# Altium schematic sheet fhd-gs.SchDoc: fhd-gs
size 453 x 317 mm; Origin: Eagle; Date: 4/28/2023 9:43:15 AM; SheetNumber: 1; GateName_1: G$1; SymbolName_1: FRAME_B_L; LibraryName: frames; DeviceSetName: FRAME_B_L; GateName_2: G$2; SymbolName_2: DOCFIELD; Sheet: Sheet:; REV: REV:
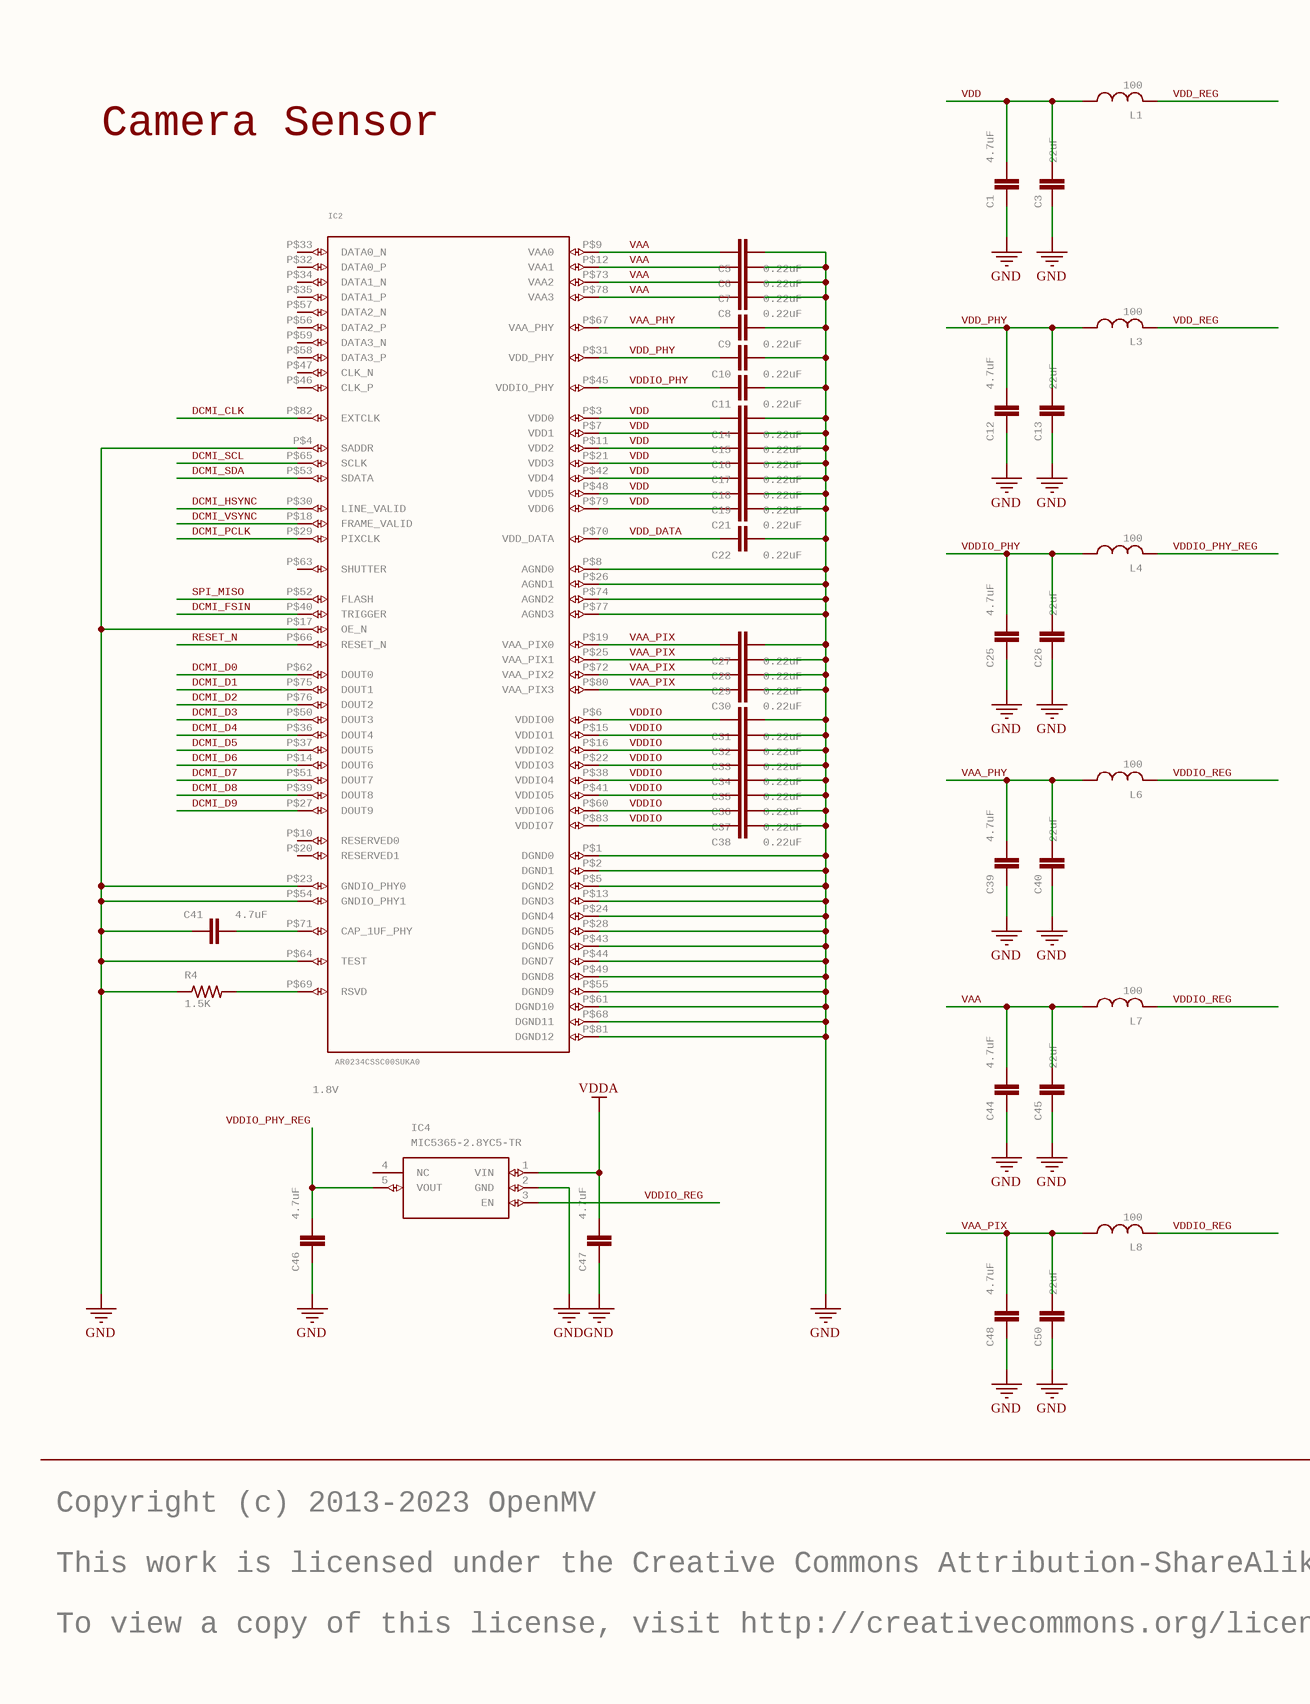
[diagram p0: fhd-gs.SchDoc, left]
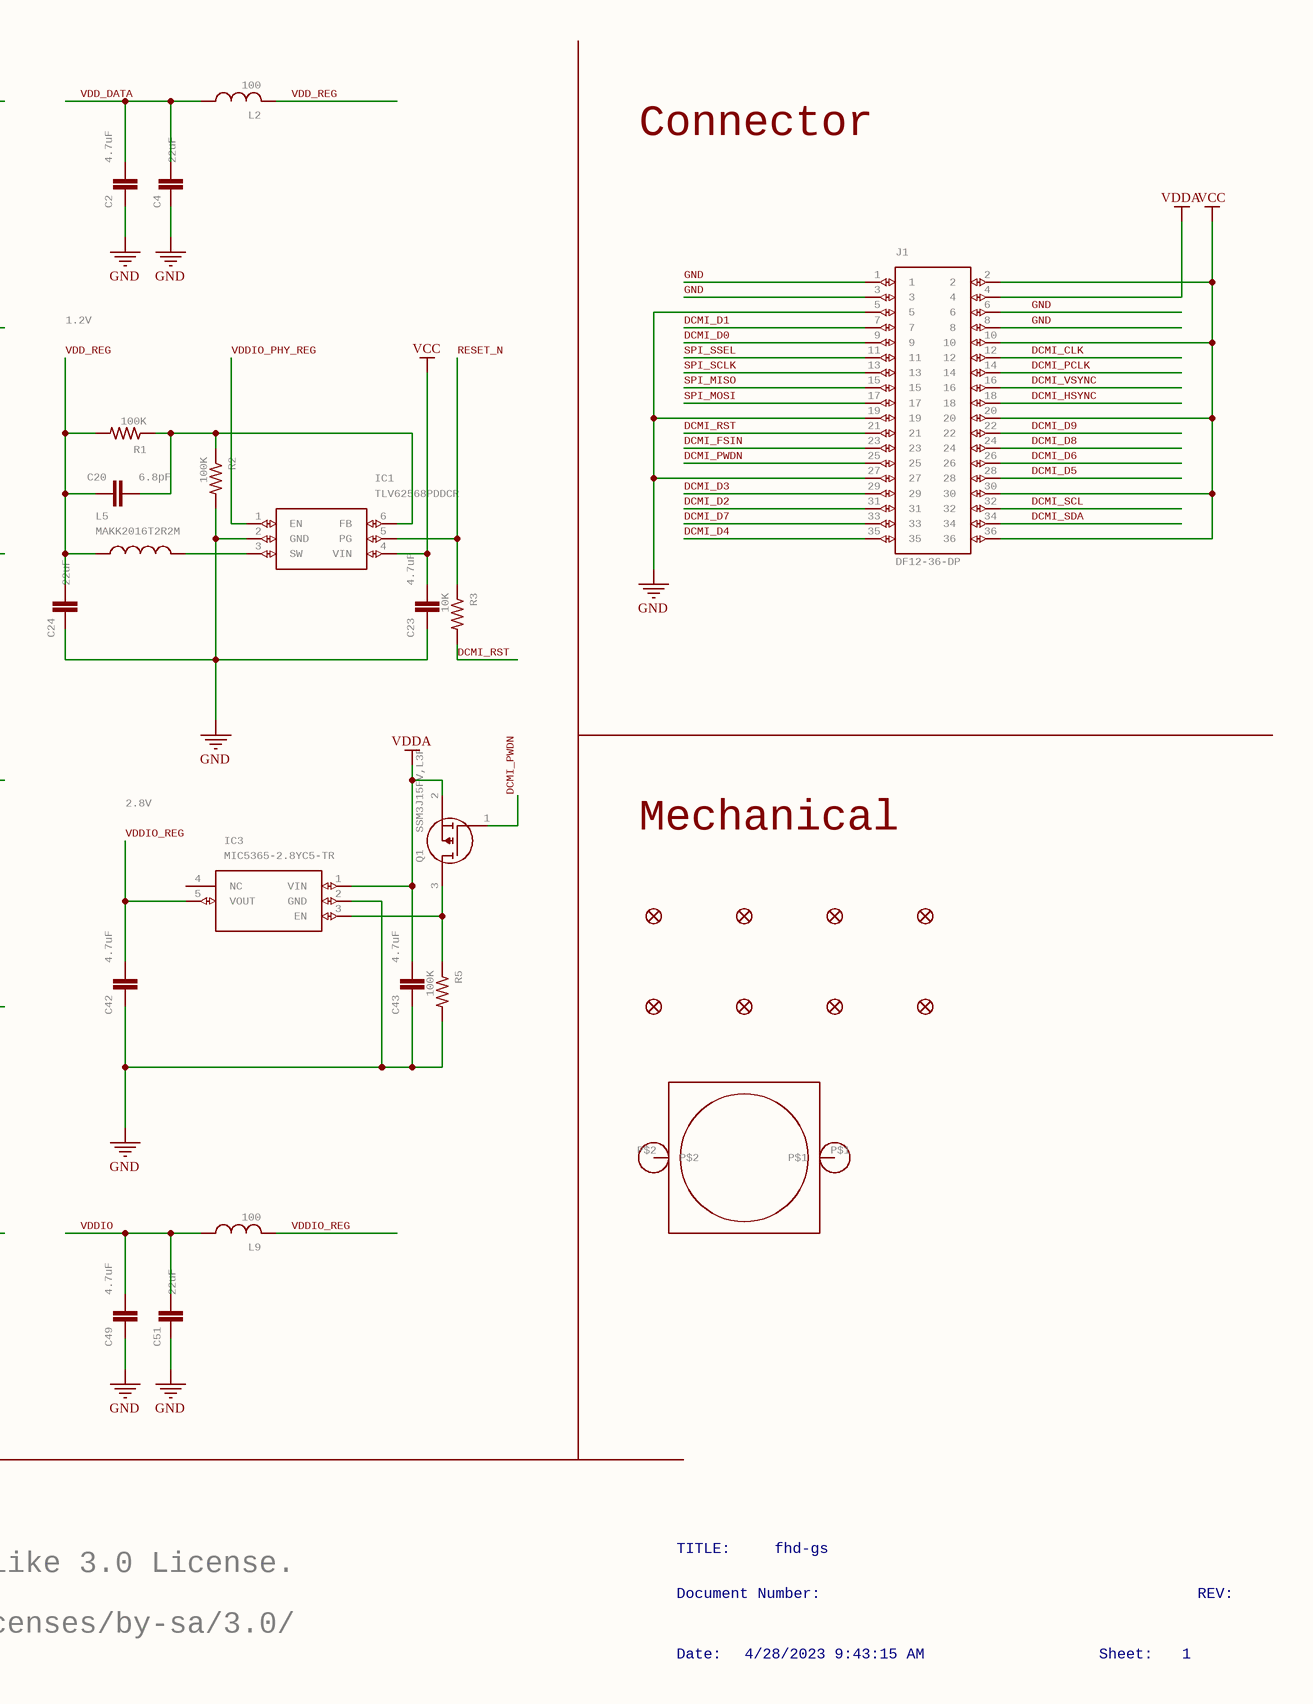
[diagram p1: fhd-gs.SchDoc, right]

## Parts
C1  4.7uF  [0402]
C2  4.7uF  [0402]
C3  22uF  [0805]
C4  22uF  [0805]
C5  0.22uF  [C0201]
C6  0.22uF  [C0201]
C7  0.22uF  [C0201]
C8  0.22uF  [C0201]
C9  0.22uF  [C0201]
C10  0.22uF  [C0201]
C11  0.22uF  [C0201]
C12  4.7uF  [0402]
C13  22uF  [0805]
C14  0.22uF  [C0201]
C15  0.22uF  [C0201]
C16  0.22uF  [C0201]
C17  0.22uF  [C0201]
C18  0.22uF  [C0201]
C19  0.22uF  [C0201]
C20  6.8pF  [0402]
C21  0.22uF  [C0201]
C22  0.22uF  [C0201]
C23  4.7uF  [0402]
C24  22uF  [0805]
C25  4.7uF  [0402]
C26  22uF  [0805]
C27  0.22uF  [C0201]
C28  0.22uF  [C0201]
C29  0.22uF  [C0201]
C30  0.22uF  [C0201]
C31  0.22uF  [C0201]
C32  0.22uF  [C0201]
C33  0.22uF  [C0201]
C34  0.22uF  [C0201]
C35  0.22uF  [C0201]
C36  0.22uF  [C0201]
C37  0.22uF  [C0201]
C38  0.22uF  [C0201]
C39  4.7uF  [0402]
C40  22uF  [0805]
C41  4.7uF  [0402]
C42  4.7uF  [0402]
C43  4.7uF  [0402]
C44  4.7uF  [0402]
C45  22uF  [0805]
C46  4.7uF  [0402]
C47  4.7uF  [0402]
C48  4.7uF  [0402]
C49  4.7uF  [0402]
C50  22uF  [0805]
C51  22uF  [0805]
FD1  FIDUCIAL1X2  [FIDUCIAL-1X2]  (value not drawn)
FD2  FIDUCIAL1X2  [FIDUCIAL-1X2]  (value not drawn)
FD3  FIDUCIAL1X2  [FIDUCIAL-1X2]  (value not drawn)
FD4  FIDUCIAL1X2  [FIDUCIAL-1X2]  (value not drawn)
FD5  FIDUCIAL1X2  [FIDUCIAL-1X2]  (value not drawn)
FD6  FIDUCIAL1X2  [FIDUCIAL-1X2]  (value not drawn)
FD7  FIDUCIAL1X2  [FIDUCIAL-1X2]  (value not drawn)
FD8  FIDUCIAL1X2  [FIDUCIAL-1X2]  (value not drawn)
H1  LENSMOUNT20MM  [LENSMOUNT-20MM]  (value not drawn)
IC1  TLV62568PDDCR  [SOT95P280X110-6N]
IC2  AR0234CSSC00SUKA0  [AR0234CSSC00SUKA0]
IC3  MIC5365-2.8YC5-TR  [SOT65P210X110-5N]
IC4  MIC5365-2.8YC5-TR  [SOT65P210X110-5N]
J1  DF12-36-DP  [DF12-36-DP]
L1  100  [0402]
L2  100  [0402]
L3  100  [0402]
L4  100  [0402]
L5  MAKK2016T2R2M  [INDC2016X100N]
L6  100  [0402]
L7  100  [0402]
L8  100  [0402]
L9  100  [0402]
Q1  SSM3J15FV,L3F  [SSM3J15FV]
R1  100K  [R0402]
R2  100K  [R0402]
R3  10K  [R0402]
R4  1.5K  [R0402]
R5  100K  [R0402]

## Nets
GND: C1.1 C2.1 C3.1 C4.1 C5.2 C6.2 C7.2 C8.2 C9.2 C10.2 C11.2 C12.1 C13.1 C14.2 C15.2 C16.2 C17.2 C18.2 C19.2 C21.2 C22.2 C23.1 C24.1 C25.1 C26.1 C27.2 C28.2 C29.2 C30.2 C31.2 C32.2 C33.2 C34.2 C35.2 C36.2 C37.2 C38.2 C39.1 C40.1 C41.1 C42.1 C43.1 C44.1 C45.1 C46.1 C47.1 C48.1 C49.1 C50.1 C51.1 IC1.2(GND) IC2.P$1(DGND0) IC2.P$2(DGND1) IC2.P$4(SADDR) IC2.P$5(DGND2) IC2.P$8(AGND0) IC2.P$13(DGND3) IC2.P$17(OE_N) IC2.P$23(GNDIO_PHY0) IC2.P$24(DGND4) IC2.P$26(AGND1) IC2.P$28(DGND5) IC2.P$43(DGND6) IC2.P$44(DGND7) IC2.P$49(DGND8) IC2.P$54(GNDIO_PHY1) IC2.P$55(DGND9) IC2.P$61(DGND10) IC2.P$64(TEST) IC2.P$68(DGND11) IC2.P$74(AGND2) IC2.P$77(AGND3) IC2.P$81(DGND12) IC3.2(GND) IC4.2(GND) J1.1 J1.3 J1.5 J1.6 J1.8 J1.19 J1.27 R2.2 R4.1 R5.2
VCC: C23.2 IC1.4(VIN) J1.2 J1.10 J1.20 J1.30 J1.36
VDDA: C43.2 C47.2 IC3.1(VIN) IC4.1(VIN) J1.4 Q1.2(S)
DCMI_CLK: IC2.P$82(EXTCLK) J1.12
DCMI_D0: IC2.P$62(DOUT0) J1.9
DCMI_D1: IC2.P$75(DOUT1) J1.7
DCMI_D2: IC2.P$76(DOUT2) J1.31
DCMI_D3: IC2.P$50(DOUT3) J1.29
DCMI_D4: IC2.P$36(DOUT4) J1.35
DCMI_D5: IC2.P$37(DOUT5) J1.28
DCMI_D6: IC2.P$14(DOUT6) J1.26
DCMI_D7: IC2.P$51(DOUT7) J1.33
DCMI_D8: IC2.P$39(DOUT8) J1.24
DCMI_D9: IC2.P$27(DOUT9) J1.22
DCMI_FSIN: IC2.P$40(TRIGGER) J1.23
DCMI_HSYNC: IC2.P$30(LINE_VALID) J1.18
DCMI_PCLK: IC2.P$29(PIXCLK) J1.14
DCMI_PWDN: J1.25 Q1.1(G)
DCMI_RST: J1.21 R3.2
DCMI_SCL: IC2.P$65(SCLK) J1.32
DCMI_SDA: IC2.P$53(SDATA) J1.34
DCMI_VSYNC: IC2.P$18(FRAME_VALID) J1.16
RESET_N: IC1.5(PG) IC2.P$66(RESET_N) R3.1
SPI_MISO: IC2.P$52(FLASH) J1.15
SPI_MOSI: J1.17
SPI_SCLK: J1.13
SPI_SSEL: J1.11
VAA: C5.1 C6.1 C7.1 C8.1 C44.2 C45.2 IC2.P$9(VAA0) IC2.P$12(VAA1) IC2.P$73(VAA2) IC2.P$78(VAA3) L7.1(P$1)
VAA_PHY: C9.1 C39.2 C40.2 IC2.P$67(VAA_PHY) L6.1(P$1)
VAA_PIX: C27.1 C28.1 C29.1 C30.1 C48.2 C50.2 IC2.P$19(VAA_PIX0) IC2.P$25(VAA_PIX1) IC2.P$72(VAA_PIX2) IC2.P$80(VAA_PIX3) L8.1(P$1)
VDD: C1.2 C3.2 C14.1 C15.1 C16.1 C17.1 C18.1 C19.1 C21.1 IC2.P$3(VDD0) IC2.P$7(VDD1) IC2.P$11(VDD2) IC2.P$21(VDD3) IC2.P$42(VDD4) IC2.P$48(VDD5) IC2.P$79(VDD6) L1.1(P$1)
VDD_DATA: C2.2 C4.2 C22.1 IC2.P$70(VDD_DATA) L2.1(P$1)
VDD_PHY: C10.1 C12.2 C13.2 IC2.P$31(VDD_PHY) L3.1(P$1)
VDD_REG: C20.1 C24.2 L1.2(P$2) L2.2(P$2) L3.2(P$2) L5.1 R1.2
VDDIO: C31.1 C32.1 C33.1 C34.1 C35.1 C36.1 C37.1 C38.1 C49.2 C51.2 IC2.P$6(VDDIO0) IC2.P$15(VDDIO1) IC2.P$16(VDDIO2) IC2.P$22(VDDIO3) IC2.P$38(VDDIO4) IC2.P$41(VDDIO5) IC2.P$60(VDDIO6) IC2.P$83(VDDIO7) L9.1(P$1)
VDDIO_PHY: C11.1 C25.2 C26.2 IC2.P$45(VDDIO_PHY) L4.1(P$1)
VDDIO_PHY_REG: C46.2 IC1.1(EN) IC4.5(VOUT) L4.2(P$2)
VDDIO_REG: C42.2 IC3.5(VOUT) IC4.3(EN) L6.2(P$2) L7.2(P$2) L8.2(P$2) L9.2(P$2)
NetC20_2: C20.2 IC1.6(FB) R1.1 R2.1
NetC41_2: C41.2 IC2.P$71(CAP_1UF_PHY)
NetIC1_3: IC1.3(SW) L5.2
NetIC2_P$69: IC2.P$69(RSVD) R4.2
NetIC3_3: IC3.3(EN) Q1.3(D) R5.1

Not connected (* = marked no-connect by the designer): H1 P$1 P$2; IC2 P$10(RESERVED0) P$20(RESERVED1) P$32(DATA0_P) P$33(DATA0_N) P$34(DATA1_N) P$35(DATA1_P) P$46(CLK_P) P$47(CLK_N) P$56(DATA2_P) P$57(DATA2_N) P$58(DATA3_P) P$59(DATA3_N) P$63(SHUTTER); IC3 4(NC); IC4 4(NC)

## Notes on the sheet
- Camera Sensor
- Connector
- 1.2V
- 2.8V
- Mechanical
- (near IC2) 1.8V
- Copyright (c) 2013-2023 OpenMV
- TITLE:
- fhd-gs
- This work is licensed under the Creative Commons Attribution-ShareAlike 3.0 License.
- To view a copy of this license, visit http://creativecommons.org/licenses/by-sa/3.0/
- Document Number:
- REV:
- Date:
- 4/28/2023 9:43:15 AM
- Sheet:
- 1

## Library data of the parts
C1 C2 C12 C23 C25 C39 C41-C44 C46-C49 = CAP_0402: 0402 (1005 Metric) Nick Garner - TeleSense; MPN: JMK105BBJ475MV-F; GateName_1: G$1; SymbolName_1: CAP; LibraryName: 0402; DeviceSetName: CAP_0402
C3 C4 C13 C24 C26 C40 C45 C50 C51 = 22UF-0805-6.3V-20%: 22ÂµF ceramic capacitors    A capacitor is a passive two-terminal electrical component used to store electrical energy temporarily in an electric field.; MPN: CL21A226MQQNNNE; GateName_1: G$1; SymbolName_1: CAP; PROD_ID: CAP-08402; DeviceName: -0805-6.3V-20%; LibraryName: SparkFun-Capacitors; DeviceSetName: 22UF
C5-C11 C14-C19 C21 C22 C27-C38 = C-EUC0201: CAPACITOR, European symbol; MPN: GRM033R60J224ME15D; GateName_1: G$1; SymbolName_1: C-EU; POPULARITY: 0; DeviceName: C0201; LibraryName: rcl; DeviceSetName: C-EU; SPICEPREFIX: C
C20 = CAP_0402: 0402 (1005 Metric) Nick Garner - TeleSense; MPN: GRM1555C1H6R8DA01D; GateName_1: G$1; SymbolName_1: CAP; LibraryName: 0402; DeviceSetName: CAP_0402
FD1-FD8 = FIDUCIAL1X2: Fiducial Alignment Points    Point-of-reference for pick-and-place machines and other optical instruments.; GateName_1: G$1; DeviceName: 1X2; SymbolName_1: FIDUCIAL; LibraryName: SparkFun-Aesthetics; DeviceSetName: FIDUCIAL
H1 = LENSMOUNT20MM: GateName_1: G$1; SymbolName_1: LENS; DeviceName: 20MM; LibraryName: lensmount; DeviceSetName: LENSMOUNT
IC1 = TLV62568PDDCR: 2.5V-5.5V input, 1A high efficiency step-down buck converter in SOT23 and SOT563 package   Source:  Datasheet; MANUFACTURER_NAME: Texas Instruments; GateName_1: G$1; SymbolName_1: TLV62568PDDCR; LibraryName: TLV62568PDDCR; DeviceSetName: TLV62568PDDCR; HEIGHT: 1.1mm; MANUFACTURER_PART_NUMBER: TLV62568PDDCR; MOUSER_PART_NUMBER: 595-TLV62568PDDCR; MOUSER_PRICE-STOCK: https://www.mouser.co.uk/ProductDetail/Texas-Instruments/TLV62568PDDCR?qs=1mbolxNpo8f1FPchIXcxyQ%3D%3D; MPN: TLV62568PDDCR
IC2 = AR0234CSSC00SUKA0: GateName_1: G$1; SymbolName_1: AR0234CSSC00SUKA0; LibraryName: AR0234CSSC00SUKA0; DeviceSetName: AR0234CSSC00SUKA0; MPN: AR0234CSSC00SUKA0
IC3 IC4 = MIC5365-2.8YC5-TR: IC REG LINEAR 2.8V 150MA SC70-5   Source:  Datasheet; MANUFACTURER_NAME: Microchip; GateName_1: G$1; SymbolName_1: MIC5365-2.8YC5-TR; LibraryName: MIC5365-2.8YC5-TR; DeviceSetName: MIC5365-2.8YC5-TR; HEIGHT: 1.1mm; MANUFACTURER_PART_NUMBER: MIC5365-2.8YC5-TR; MOUSER_PART_NUMBER: 998-MIC5365-2.8YC5TR; MOUSER_PRICE-STOCK: https://www.mouser.co.uk/ProductDetail/Microchip-Technology-Atmel/MIC5365-2.8YC5-TR?qs=U6T8BxXiZAX3mJDSWJyjVA%3D%3D; MPN: MIC5365-2.8YC5-TR
J1 = DF12-36-DP: MPN: DF12NB(3.0)-36DP-0.5V(51); GateName_1: G$1; SymbolName_1: DF12-36; LibraryName: DF12NB(3.0)-36DP-0.5V(51); DeviceSetName: DF12-36-DP
L1-L4 L6-L9 = INDUCTOR_0402: MPN: MFBM1V1005-101-R; GateName_1: G$1; SymbolName_1: INDUCTOR; LibraryName: 0402; DeviceSetName: INDUCTOR_0402
L5 = MAKK2016T2R2M: INDUCTOR, METAL CORE Check availability; GateName_1: G$1; MF: Taiyo Yuden; SymbolName_1: MAKK2016T2R2M; LibraryName: MAKK2016T2R2M; DeviceSetName: MAKK2016T2R2M; AVAILABILITY: In Stock; MP: MAKK2016T2R2M; MPN: MAKK2016T2R2M; PACKAGE: 2016 Taiyo Yuden; PRICE: None; PURCHASE-URL: https://pricing.snapeda.com/search/part/MAKK2016T2R2M/?ref=eda
Q1 = PMXB120EPEZ: MOSFET 30 V, P-channel Trench MOSFET   Source:  Datasheet; GateName_1: G$1; SymbolName_1: SSM3J15FV,L3F; LibraryName: SSM3J15FV,L3F; DeviceSetName: SSM3J15FV,L3F; HEIGHT: 0.4mm; MANUFACTURER_PART_NUMBER: SSM3J15FV,L3F; MOUSER_PART_NUMBER: SSM3J15FV,L3F; MPN: SSM3J15FV,L3F
R1 R2 R5 = R-US_R0402: RESISTOR, American symbol; MPN: AC0402FR-07100KL; GateName_1: G$1; SymbolName_1: R-US; DeviceSetName: R-US_; POPULARITY: 34; DeviceName: R0402; LibraryName: rcl; SPICEPREFIX: R
R3 = R-US_R0402: RESISTOR, American symbol; MPN: AC0402FR-1310KL; GateName_1: G$1; SymbolName_1: R-US; DeviceSetName: R-US_; POPULARITY: 34; DeviceName: R0402; LibraryName: rcl; SPICEPREFIX: R
R4 = R-US_R0402: RESISTOR, American symbol; MPN: RC0402FR-131K5L; GateName_1: G$1; SymbolName_1: R-US; DeviceSetName: R-US_; POPULARITY: 34; DeviceName: R0402; LibraryName: rcl; SPICEPREFIX: R